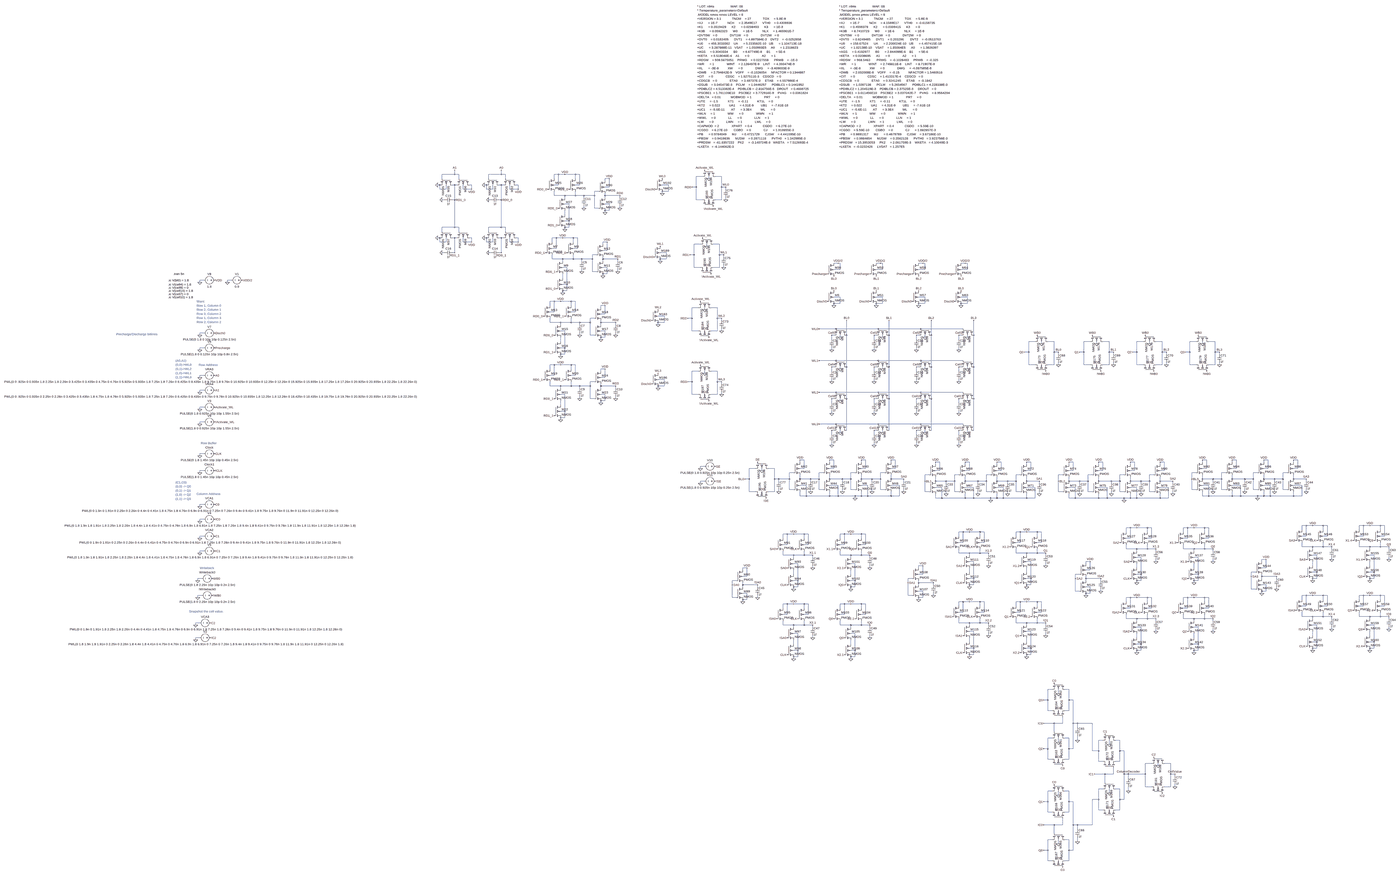
[diagram p0: schematic FinalProjectDraft4.asc, whole sheet]
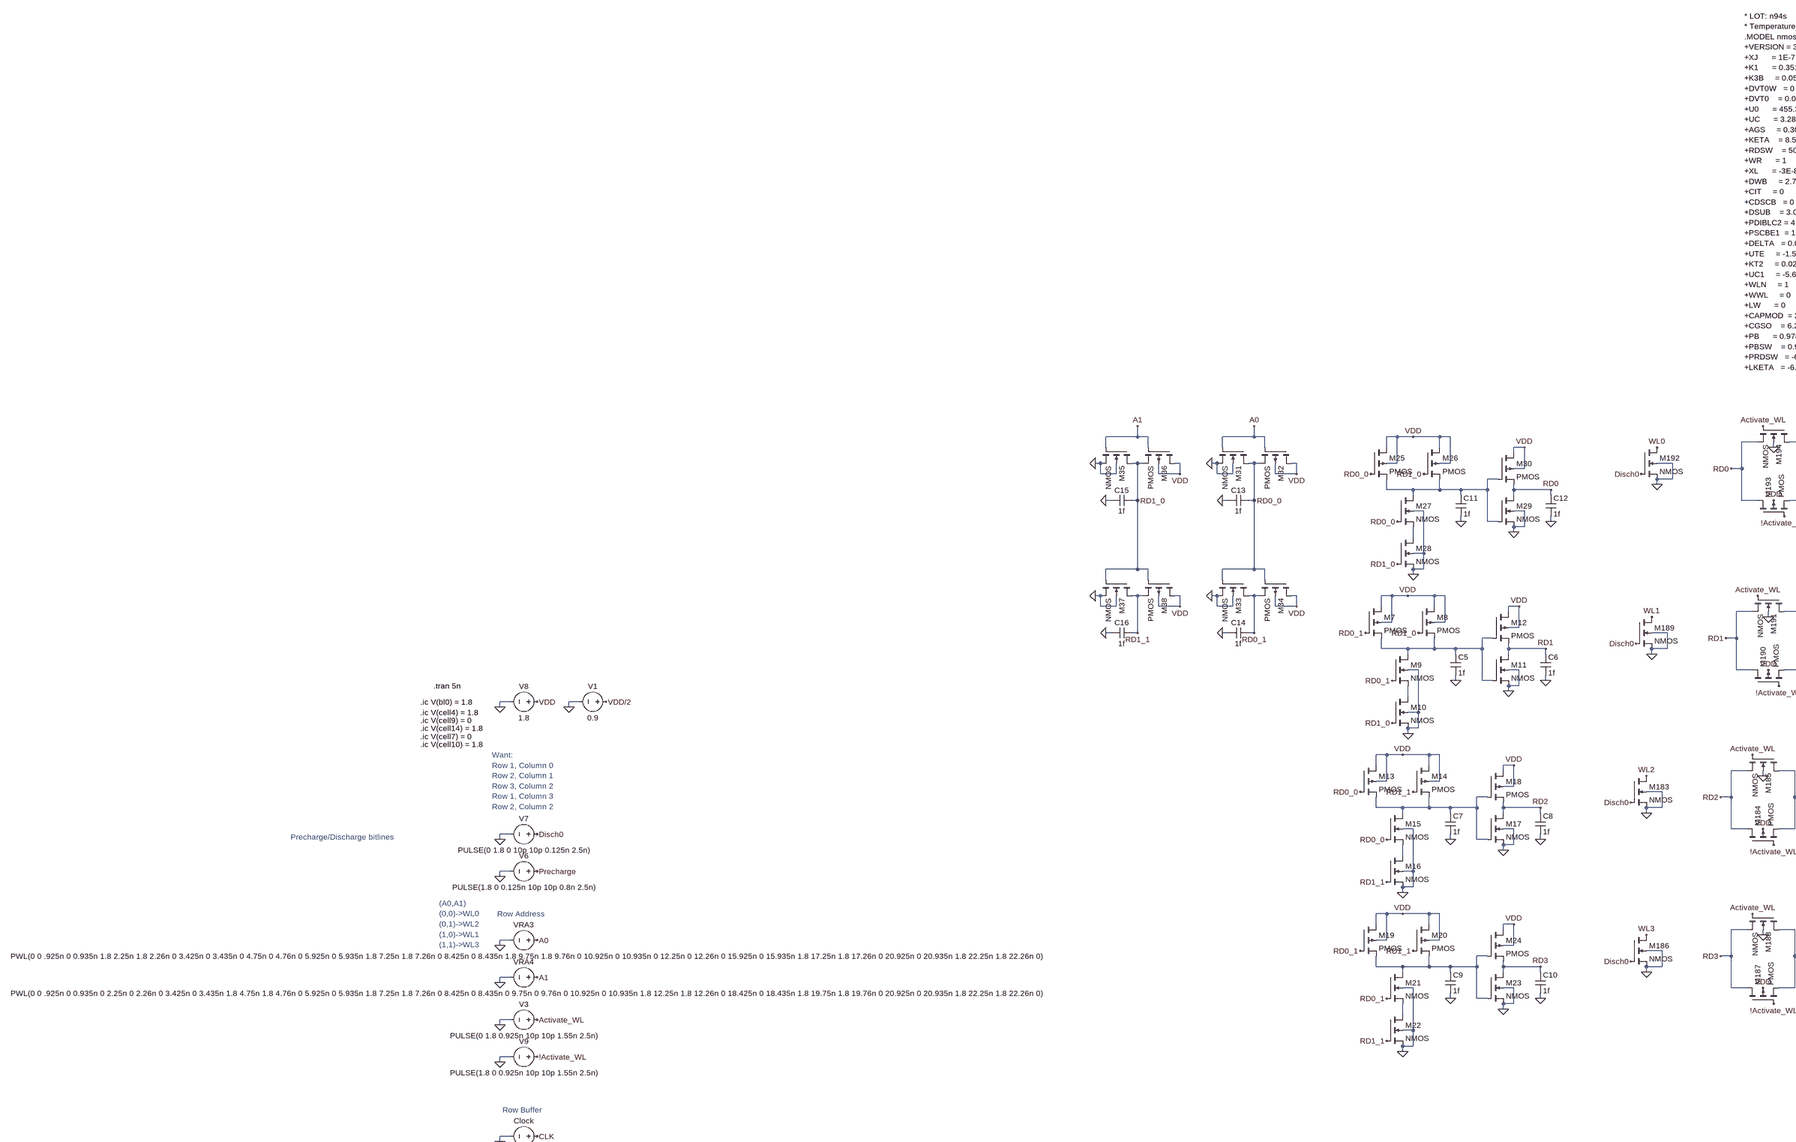
[diagram p1: schematic FinalProjectDraft4.asc, part, row 1 of 2, column 1 of 2]
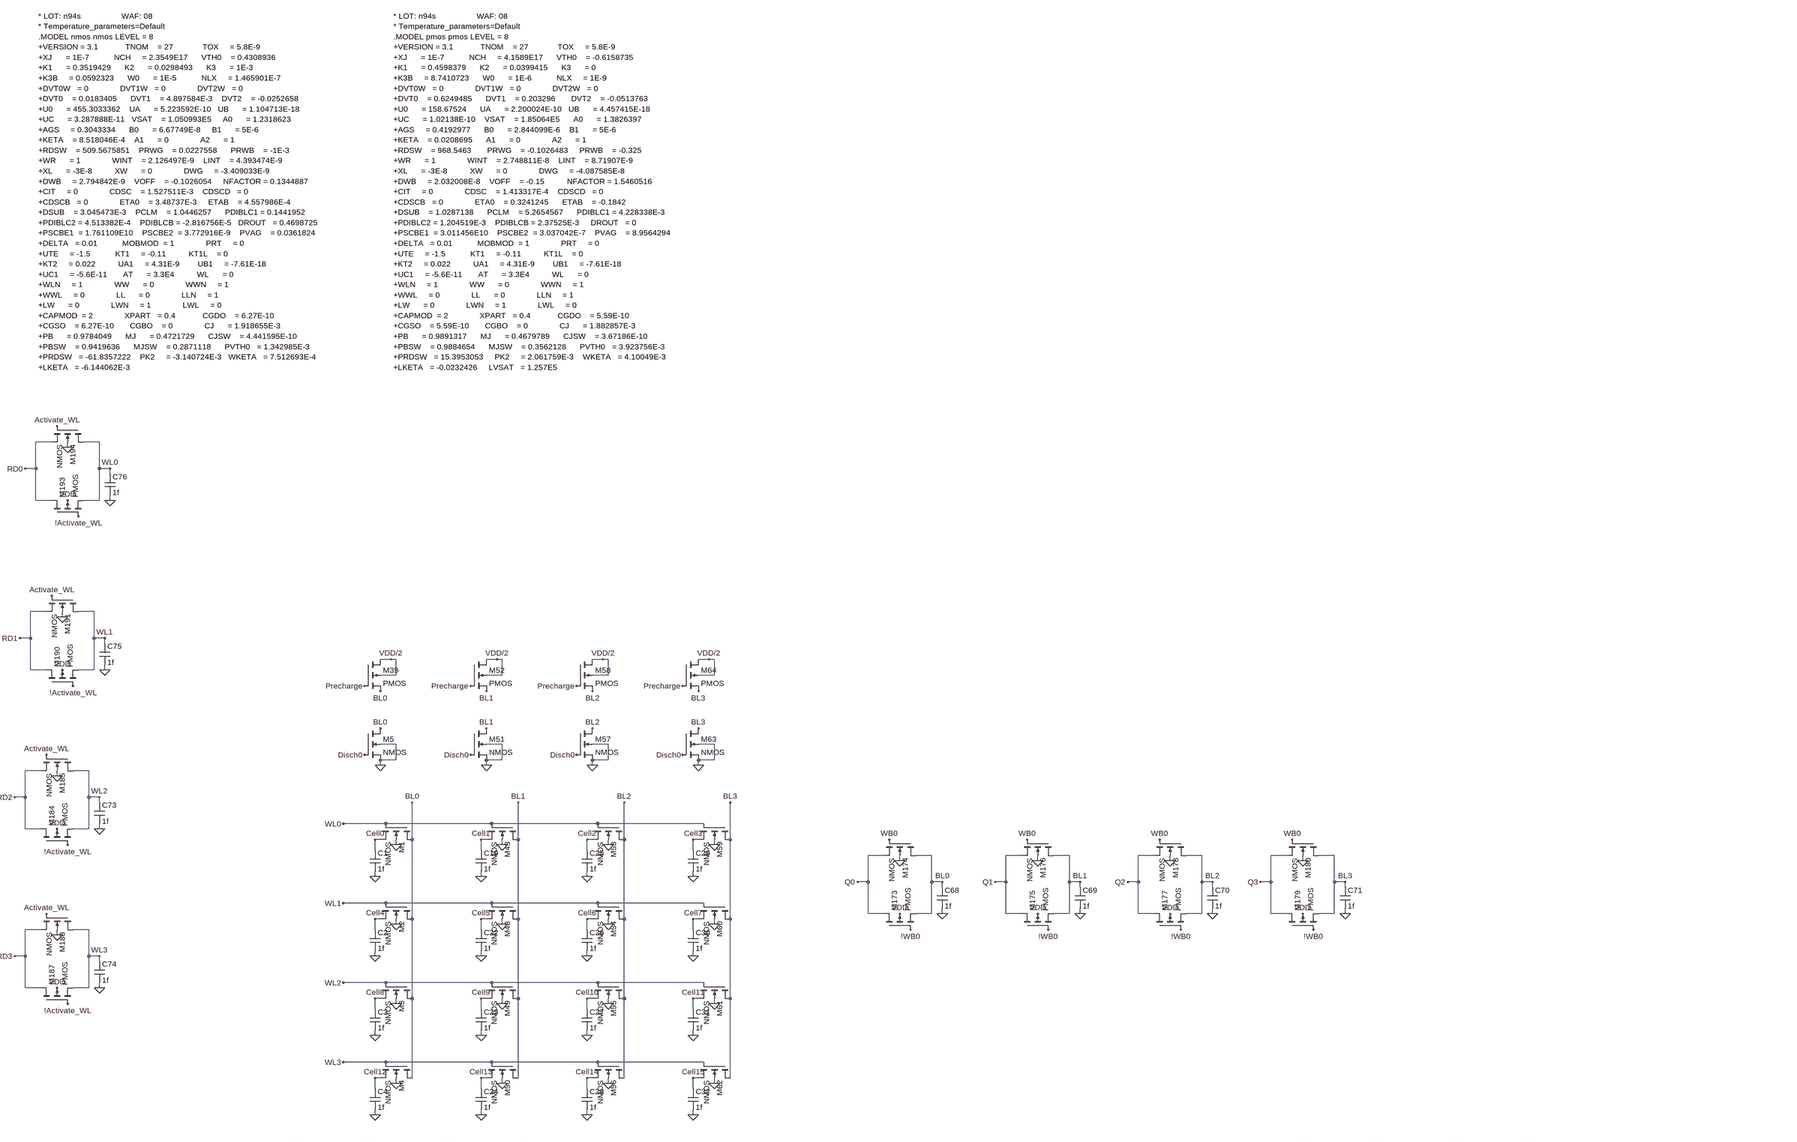
[diagram p2: schematic FinalProjectDraft4.asc, part, row 1 of 2, column 2 of 2]
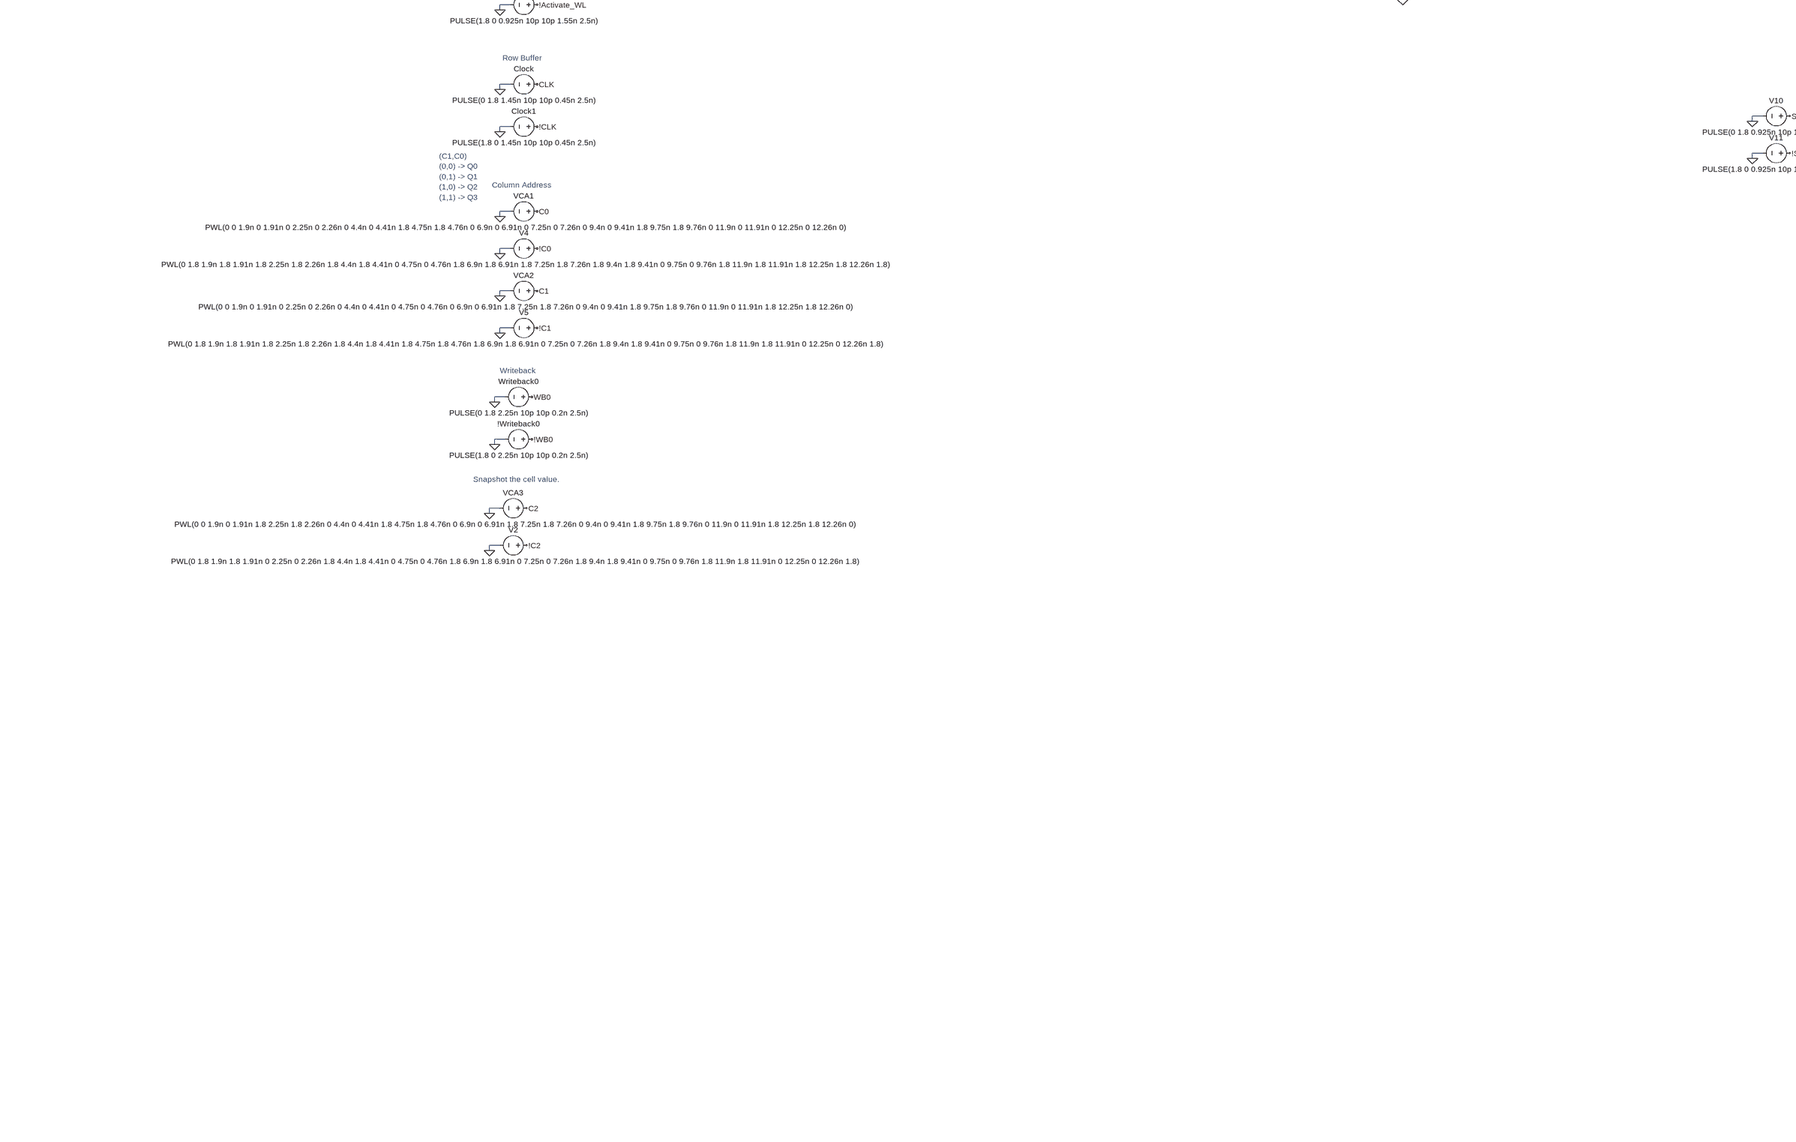
[diagram p3: schematic FinalProjectDraft4.asc, part, row 2 of 2, column 1 of 2]
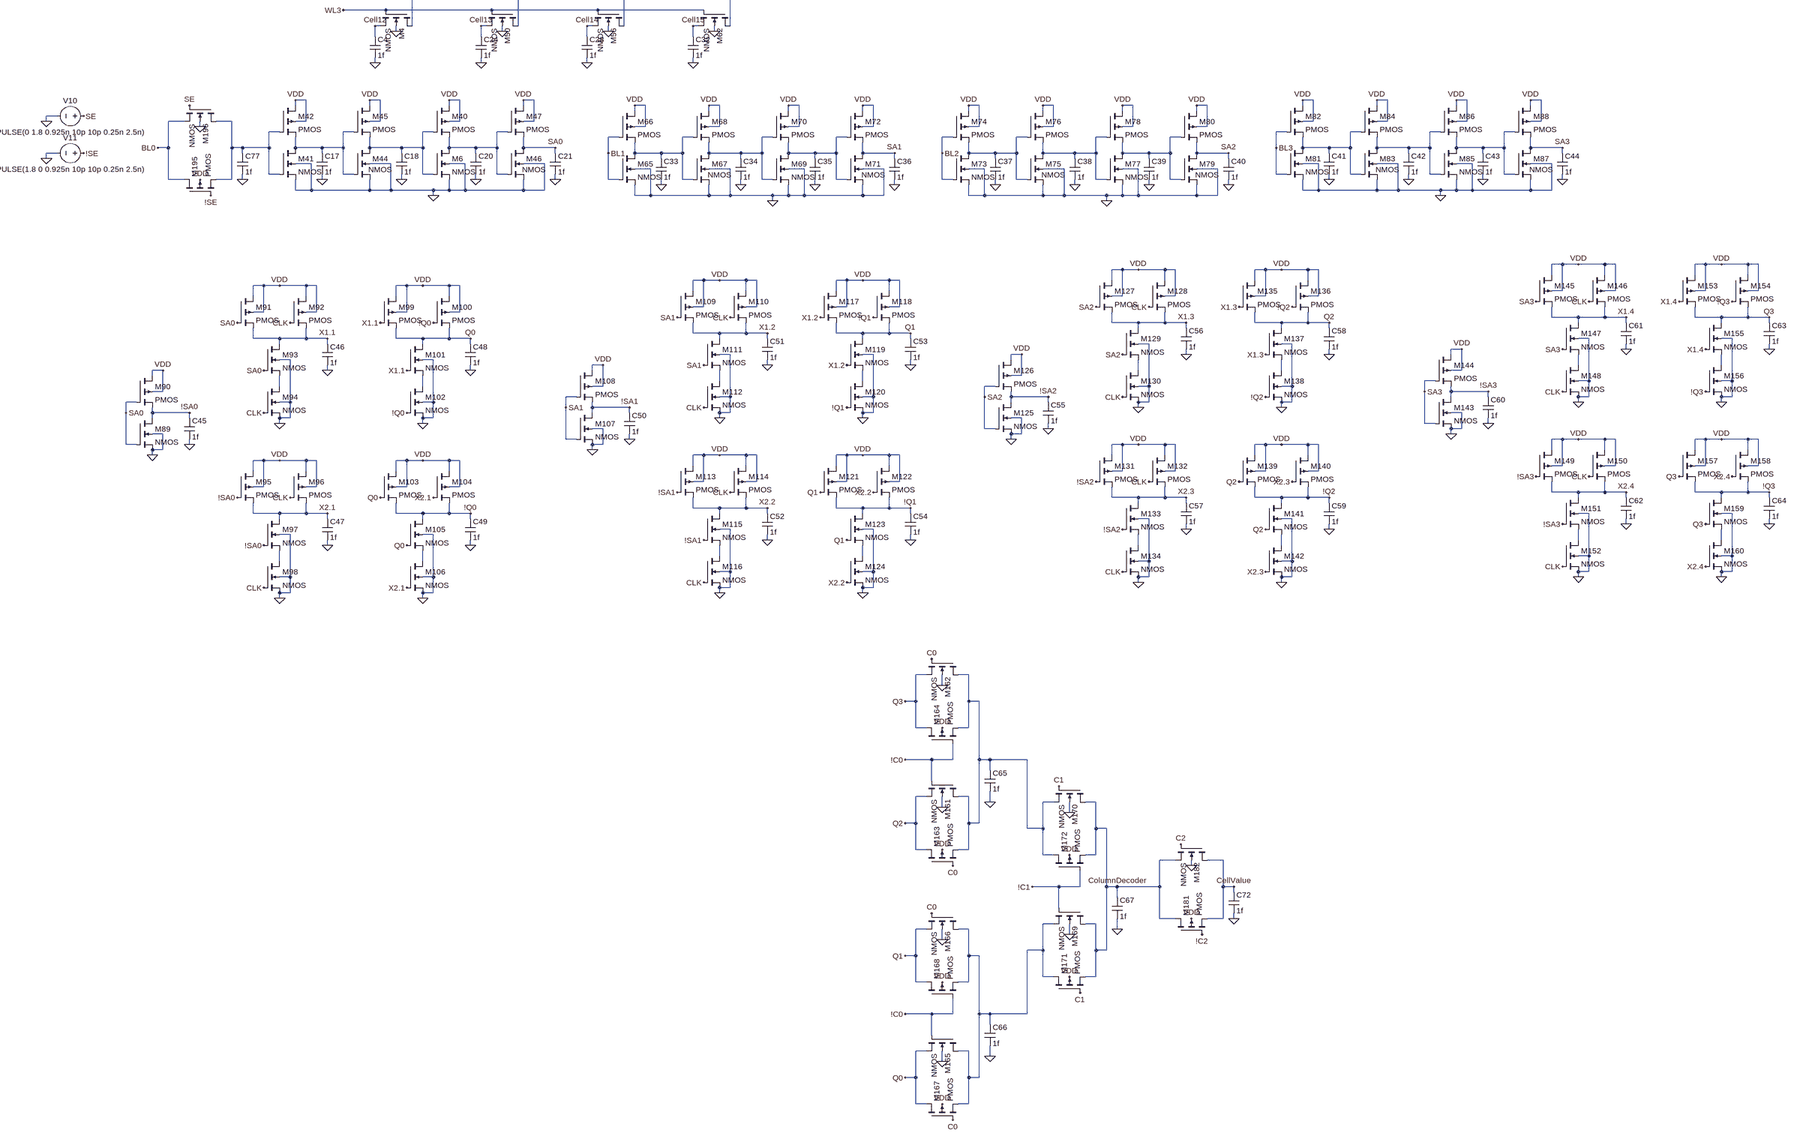
[diagram p4: schematic FinalProjectDraft4.asc, part, row 2 of 2, column 2 of 2]
* FinalProjectDraft4.asc
M1 BL0 WL0 Cell0 0 NMOS l=180n w=440n
C1 Cell0 0 1f
M2 BL0 WL1 Cell4 0 NMOS l=180n w=440n
C2 Cell4 0 1f
M3 BL0 WL2 Cell8 0 NMOS l=180n w=440n
C3 Cell8 0 1f
M4 BL0 WL3 Cell12 0 NMOS l=180n w=440n
C4 Cell12 0 1f
M5 BL0 Disch0 0 0 NMOS l=180n w=440n
M7 VDD RD0_1 N003 VDD PMOS l=180n w=880n
M8 VDD RD1_0 N003 VDD PMOS l=180n w=880n
M9 N003 RD0_1 N004 0 NMOS l=180n w=880n
M10 N004 RD1_0 0 0 NMOS l=180n w=880n
C5 N003 0 1f
M11 RD1 N003 0 0 NMOS l=180n w=440n
M12 VDD N003 RD1 VDD PMOS l=180n w=880n
C6 RD1 0 1f
M13 VDD RD0_0 N005 VDD PMOS l=180n w=880n
M14 VDD RD1_1 N005 VDD PMOS l=180n w=880n
M15 N005 RD0_0 N006 0 NMOS l=180n w=880n
M16 N006 RD1_1 0 0 NMOS l=180n w=880n
C7 N005 0 1f
M17 RD2 N005 0 0 NMOS l=180n w=440n
M18 VDD N005 RD2 VDD PMOS l=180n w=880n
C8 RD2 0 1f
M19 VDD RD0_1 N007 VDD PMOS l=180n w=880n
M20 VDD RD1_1 N007 VDD PMOS l=180n w=880n
M21 N007 RD0_1 N008 0 NMOS l=180n w=880n
M22 N008 RD1_1 0 0 NMOS l=180n w=880n
C9 N007 0 1f
M23 RD3 N007 0 0 NMOS l=180n w=440n
M24 VDD N007 RD3 VDD PMOS l=180n w=880n
C10 RD3 0 1f
M25 VDD RD0_0 N001 VDD PMOS l=180n w=880n
M26 VDD RD1_0 N001 VDD PMOS l=180n w=880n
M27 N001 RD0_0 N002 0 NMOS l=180n w=880n
M28 N002 RD1_0 0 0 NMOS l=180n w=880n
C11 N001 0 1f
M29 RD0 N001 0 0 NMOS l=180n w=440n
M30 VDD N001 RD0 VDD PMOS l=180n w=880n
C12 RD0 0 1f
M31 RD0_0 A0 0 0 NMOS l=180n w=440n
M32 VDD A0 RD0_0 VDD PMOS l=180n w=880n
C13 RD0_0 0 1f
M33 RD0_1 RD0_0 0 0 NMOS l=180n w=440n
M34 VDD RD0_0 RD0_1 VDD PMOS l=180n w=880n
C14 RD0_1 0 1f
M35 RD1_0 A1 0 0 NMOS l=180n w=440n
M36 VDD A1 RD1_0 VDD PMOS l=180n w=880n
C15 RD1_0 0 1f
M37 RD1_1 RD1_0 0 0 NMOS l=180n w=440n
M38 VDD RD1_0 RD1_1 VDD PMOS l=180n w=880n
C16 RD1_1 0 1f
M39 VDD/2 Precharge BL0 VDD/2 PMOS l=180n w=440n
M41 N010 N009 0 0 NMOS l=180n w=440n
M42 VDD N009 N010 VDD PMOS l=180n w=880n
M44 N011 N010 0 0 NMOS l=180n w=440n
M45 VDD N010 N011 VDD PMOS l=180n w=880n
VRA3 A0 0 PWL(0 0 .925n 0 0.935n 1.8 2.25n 1.8 2.26n 0 3.425n 0 3.435n 0 4.75n 0 4.76n 0 5.925n 0 5.935n 1.8 7.25n 1.8 7.26n 0 8.425n 0 8.435n 1.8 9.75n 1.8 9.76n 0 10.925n 0 10.935n 0 12.25n 0 12.26n 0 15.925n 0 15.935n 1.8 17.25n 1.8 17.26n 0 20.925n 0 20.935n 1.8 22.25n 1.8 22.26n 0)
VRA4 A1 0 PWL(0 0 .925n 0 0.935n 0 2.25n 0 2.26n 0 3.425n 0 3.435n 1.8 4.75n 1.8 4.76n 0 5.925n 0 5.935n 1.8 7.25n 1.8 7.26n 0 8.425n 0 8.435n 0 9.75n 0 9.76n 0 10.925n 0 10.935n 1.8 12.25n 1.8 12.26n 0 18.425n 0 18.435n 1.8 19.75n 1.8 19.76n 0 20.925n 0 20.935n 1.8 22.25n 1.8 22.26n 0)
VCA1 C0 0 PWL(0 0 1.9n 0 1.91n 0 2.25n 0 2.26n 0 4.4n 0 4.41n 1.8 4.75n 1.8 4.76n 0 6.9n 0 6.91n 0 7.25n 0 7.26n 0 9.4n 0 9.41n 1.8 9.75n 1.8 9.76n 0 11.9n 0 11.91n 0 12.25n 0 12.26n 0)
VCA2 C1 0 PWL(0 0 1.9n 0 1.91n 0 2.25n 0 2.26n 0 4.4n 0 4.41n 0 4.75n 0 4.76n 0 6.9n 0 6.91n 1.8 7.25n 1.8 7.26n 0 9.4n 0 9.41n 1.8 9.75n 1.8 9.76n 0 11.9n 0 11.91n 1.8 12.25n 1.8 12.26n 0)
V4 !C0 0 PWL(0 1.8 1.9n 1.8 1.91n 1.8 2.25n 1.8 2.26n 1.8 4.4n 1.8 4.41n 0 4.75n 0 4.76n 1.8 6.9n 1.8 6.91n 1.8 7.25n 1.8 7.26n 1.8 9.4n 1.8 9.41n 0 9.75n 0 9.76n 1.8 11.9n 1.8 11.91n 1.8 12.25n 1.8 12.26n 1.8)
V5 !C1 0 PWL(0 1.8 1.9n 1.8 1.91n 1.8 2.25n 1.8 2.26n 1.8 4.4n 1.8 4.41n 1.8 4.75n 1.8 4.76n 1.8 6.9n 1.8 6.91n 0 7.25n 0 7.26n 1.8 9.4n 1.8 9.41n 0 9.75n 0 9.76n 1.8 11.9n 1.8 11.91n 0 12.25n 0 12.26n 1.8)
V6 Precharge 0 PULSE(1.8 0 0.125n 10p 10p 0.8n 2.5n)
V7 Disch0 0 PULSE(0 1.8 0 10p 10p 0.125n 2.5n)
C17 N010 0 1f
C18 N011 0 1f
M6 N012 N011 0 0 NMOS l=180n w=440n
M40 VDD N011 N012 VDD PMOS l=180n w=880n
M46 SA0 N012 0 0 NMOS l=180n w=440n
M47 VDD N012 SA0 VDD PMOS l=180n w=880n
C20 N012 0 1f
C21 SA0 0 1f
V8 VDD 0 1.8
V1 VDD/2 0 0.9
M43 BL1 WL0 Cell1 0 NMOS l=180n w=440n
C19 Cell1 0 1f
M48 BL1 WL1 Cell5 0 NMOS l=180n w=440n
C22 Cell5 0 1f
M49 BL1 WL2 Cell9 0 NMOS l=180n w=440n
C23 Cell9 0 1f
M50 BL1 WL3 Cell13 0 NMOS l=180n w=440n
C24 Cell13 0 1f
M51 BL1 Disch0 0 0 NMOS l=180n w=440n
M52 VDD/2 Precharge BL1 VDD/2 PMOS l=180n w=440n
M53 BL2 WL0 Cell2 0 NMOS l=180n w=440n
C25 Cell2 0 1f
M54 BL2 WL1 Cell6 0 NMOS l=180n w=440n
C26 Cell6 0 1f
M55 BL2 WL2 Cell10 0 NMOS l=180n w=440n
C27 Cell10 0 1f
M56 BL2 WL3 Cell14 0 NMOS l=180n w=440n
C28 Cell14 0 1f
M57 BL2 Disch0 0 0 NMOS l=180n w=440n
M58 VDD/2 Precharge BL2 VDD/2 PMOS l=180n w=440n
M59 BL3 WL0 Cell3 0 NMOS l=180n w=440n
C29 Cell3 0 1f
M60 BL3 WL1 Cell7 0 NMOS l=180n w=440n
C30 Cell7 0 1f
M61 BL3 WL2 Cell11 0 NMOS l=180n w=440n
C31 Cell11 0 1f
M62 BL3 WL3 Cell15 0 NMOS l=180n w=440n
C32 Cell15 0 1f
M63 BL3 Disch0 0 0 NMOS l=180n w=440n
M64 VDD/2 Precharge BL3 VDD/2 PMOS l=180n w=440n
M65 N016 BL1 0 0 NMOS l=180n w=440n
M66 VDD BL1 N016 VDD PMOS l=180n w=880n
M67 N017 N016 0 0 NMOS l=180n w=440n
M68 VDD N016 N017 VDD PMOS l=180n w=880n
C33 N016 0 1f
C34 N017 0 1f
M69 N018 N017 0 0 NMOS l=180n w=440n
M70 VDD N017 N018 VDD PMOS l=180n w=880n
M71 SA1 N018 0 0 NMOS l=180n w=440n
M72 VDD N018 SA1 VDD PMOS l=180n w=880n
C35 N018 0 1f
C36 SA1 0 1f
M73 N019 BL2 0 0 NMOS l=180n w=440n
M74 VDD BL2 N019 VDD PMOS l=180n w=880n
M75 N020 N019 0 0 NMOS l=180n w=440n
M76 VDD N019 N020 VDD PMOS l=180n w=880n
C37 N019 0 1f
C38 N020 0 1f
M77 N021 N020 0 0 NMOS l=180n w=440n
M78 VDD N020 N021 VDD PMOS l=180n w=880n
M79 SA2 N021 0 0 NMOS l=180n w=440n
M80 VDD N021 SA2 VDD PMOS l=180n w=880n
C39 N021 0 1f
C40 SA2 0 1f
M81 N013 BL3 0 0 NMOS l=180n w=440n
M82 VDD BL3 N013 VDD PMOS l=180n w=880n
M83 N014 N013 0 0 NMOS l=180n w=440n
M84 VDD N013 N014 VDD PMOS l=180n w=880n
C41 N013 0 1f
C42 N014 0 1f
M85 N015 N014 0 0 NMOS l=180n w=440n
M86 VDD N014 N015 VDD PMOS l=180n w=880n
M87 SA3 N015 0 0 NMOS l=180n w=440n
M88 VDD N015 SA3 VDD PMOS l=180n w=880n
C43 N015 0 1f
C44 SA3 0 1f
M89 !SA0 SA0 0 0 NMOS l=180n w=440n
M90 VDD SA0 !SA0 VDD PMOS l=180n w=880n
C45 !SA0 0 1f
M91 VDD SA0 X1.1 VDD PMOS l=180n w=880n
M92 VDD CLK X1.1 VDD PMOS l=180n w=880n
M93 X1.1 SA0 N028 0 NMOS l=180n w=880n
M94 N028 CLK 0 0 NMOS l=180n w=880n
C46 X1.1 0 1f
M95 VDD !SA0 X2.1 VDD PMOS l=180n w=880n
M96 VDD CLK X2.1 VDD PMOS l=180n w=880n
M97 X2.1 !SA0 N036 0 NMOS l=180n w=880n
M98 N036 CLK 0 0 NMOS l=180n w=880n
C47 X2.1 0 1f
M99 VDD X1.1 Q0 VDD PMOS l=180n w=880n
M100 VDD !Q0 Q0 VDD PMOS l=180n w=880n
M101 Q0 X1.1 N029 0 NMOS l=180n w=880n
M102 N029 !Q0 0 0 NMOS l=180n w=880n
C48 Q0 0 1f
M103 VDD Q0 !Q0 VDD PMOS l=180n w=880n
M104 VDD X2.1 !Q0 VDD PMOS l=180n w=880n
M105 !Q0 Q0 N037 0 NMOS l=180n w=880n
M106 N037 X2.1 0 0 NMOS l=180n w=880n
C49 !Q0 0 1f
M107 !SA1 SA1 0 0 NMOS l=180n w=440n
M108 VDD SA1 !SA1 VDD PMOS l=180n w=880n
C50 !SA1 0 1f
M109 VDD SA1 X1.2 VDD PMOS l=180n w=880n
M110 VDD CLK X1.2 VDD PMOS l=180n w=880n
M111 X1.2 SA1 N026 0 NMOS l=180n w=880n
M112 N026 CLK 0 0 NMOS l=180n w=880n
C51 X1.2 0 1f
M113 VDD !SA1 X2.2 VDD PMOS l=180n w=880n
M114 VDD CLK X2.2 VDD PMOS l=180n w=880n
M115 X2.2 !SA1 N034 0 NMOS l=180n w=880n
M116 N034 CLK 0 0 NMOS l=180n w=880n
C52 X2.2 0 1f
M117 VDD X1.2 Q1 VDD PMOS l=180n w=880n
M118 VDD !Q1 Q1 VDD PMOS l=180n w=880n
M119 Q1 X1.2 N027 0 NMOS l=180n w=880n
M120 N027 !Q1 0 0 NMOS l=180n w=880n
C53 Q1 0 1f
M121 VDD Q1 !Q1 VDD PMOS l=180n w=880n
M122 VDD X2.2 !Q1 VDD PMOS l=180n w=880n
M123 !Q1 Q1 N035 0 NMOS l=180n w=880n
M124 N035 X2.2 0 0 NMOS l=180n w=880n
C54 !Q1 0 1f
M125 !SA2 SA2 0 0 NMOS l=180n w=440n
M126 VDD SA2 !SA2 VDD PMOS l=180n w=880n
C55 !SA2 0 1f
M127 VDD SA2 X1.3 VDD PMOS l=180n w=880n
M128 VDD CLK X1.3 VDD PMOS l=180n w=880n
M129 X1.3 SA2 N024 0 NMOS l=180n w=880n
M130 N024 CLK 0 0 NMOS l=180n w=880n
C56 X1.3 0 1f
M131 VDD !SA2 X2.3 VDD PMOS l=180n w=880n
M132 VDD CLK X2.3 VDD PMOS l=180n w=880n
M133 X2.3 !SA2 N032 0 NMOS l=180n w=880n
M134 N032 CLK 0 0 NMOS l=180n w=880n
C57 X2.3 0 1f
M135 VDD X1.3 Q2 VDD PMOS l=180n w=880n
M136 VDD !Q2 Q2 VDD PMOS l=180n w=880n
M137 Q2 X1.3 N025 0 NMOS l=180n w=880n
M138 N025 !Q2 0 0 NMOS l=180n w=880n
C58 Q2 0 1f
M139 VDD Q2 !Q2 VDD PMOS l=180n w=880n
M140 VDD X2.3 !Q2 VDD PMOS l=180n w=880n
M141 !Q2 Q2 N033 0 NMOS l=180n w=880n
M142 N033 X2.3 0 0 NMOS l=180n w=880n
C59 !Q2 0 1f
M143 !SA3 SA3 0 0 NMOS l=180n w=440n
M144 VDD SA3 !SA3 VDD PMOS l=180n w=880n
C60 !SA3 0 1f
M145 VDD SA3 X1.4 VDD PMOS l=180n w=880n
M146 VDD CLK X1.4 VDD PMOS l=180n w=880n
M147 X1.4 SA3 N022 0 NMOS l=180n w=880n
M148 N022 CLK 0 0 NMOS l=180n w=880n
C61 X1.4 0 1f
M149 VDD !SA3 X2.4 VDD PMOS l=180n w=880n
M150 VDD CLK X2.4 VDD PMOS l=180n w=880n
M151 X2.4 !SA3 N030 0 NMOS l=180n w=880n
M152 N030 CLK 0 0 NMOS l=180n w=880n
C62 X2.4 0 1f
M153 VDD X1.4 Q3 VDD PMOS l=180n w=880n
M154 VDD !Q3 Q3 VDD PMOS l=180n w=880n
M155 Q3 X1.4 N023 0 NMOS l=180n w=880n
M156 N023 !Q3 0 0 NMOS l=180n w=880n
C63 Q3 0 1f
M157 VDD Q3 !Q3 VDD PMOS l=180n w=880n
M158 VDD X2.4 !Q3 VDD PMOS l=180n w=880n
M159 !Q3 Q3 N031 0 NMOS l=180n w=880n
M160 N031 X2.4 0 0 NMOS l=180n w=880n
C64 !Q3 0 1f
M161 N038 !C0 Q2 0 NMOS l=180n w=440n
M162 N038 C0 Q3 0 NMOS l=180n w=440n
M163 Q2 C0 N038 VDD PMOS l=180n w=440n
M164 Q3 !C0 N038 VDD PMOS l=180n w=440n
C65 N038 0 1f
M165 N039 !C0 Q0 0 NMOS l=180n w=440n
M166 N039 C0 Q1 0 NMOS l=180n w=440n
M167 Q0 C0 N039 VDD PMOS l=180n w=440n
M168 Q1 !C0 N039 VDD PMOS l=180n w=440n
C66 N039 0 1f
M169 ColumnDecoder !C1 N039 0 NMOS l=180n w=440n
M170 ColumnDecoder C1 N038 0 NMOS l=180n w=440n
M171 N039 C1 ColumnDecoder VDD PMOS l=180n w=440n
M172 N038 !C1 ColumnDecoder VDD PMOS l=180n w=440n
C67 ColumnDecoder 0 1f
V§Clock CLK 0 PULSE(0 1.8 1.45n 10p 10p 0.45n 2.5n)
V§Clock1 !CLK 0 PULSE(1.8 0 1.45n 10p 10p 0.45n 2.5n)
M173 Q0 !WB0 BL0 VDD PMOS l=180n w=440n
M174 BL0 WB0 Q0 0 NMOS l=180n w=440n
C68 BL0 0 1f
M175 Q1 !WB0 BL1 VDD PMOS l=180n w=880n
M176 BL1 WB0 Q1 0 NMOS l=180n w=440n
C69 BL1 0 1f
M177 Q2 !WB0 BL2 VDD PMOS l=180n w=880n
M178 BL2 WB0 Q2 0 NMOS l=180n w=440n
C70 BL2 0 1f
M179 Q3 !WB0 BL3 VDD PMOS l=180n w=880n
M180 BL3 WB0 Q3 0 NMOS l=180n w=440n
C71 BL3 0 1f
V§Writeback0 WB0 0 PULSE(0 1.8 2.25n 10p 10p 0.2n 2.5n)
V§!Writeback0 !WB0 0 PULSE(1.8 0 2.25n 10p 10p 0.2n 2.5n)
M181 ColumnDecoder !C2 CellValue VDD PMOS l=180n w=440n
M182 CellValue C2 ColumnDecoder 0 NMOS l=180n w=440n
C72 CellValue 0 1f
VCA3 C2 0 PWL(0 0 1.9n 0 1.91n 1.8 2.25n 1.8 2.26n 0 4.4n 0 4.41n 1.8 4.75n 1.8 4.76n 0 6.9n 0 6.91n 1.8 7.25n 1.8 7.26n 0 9.4n 0 9.41n 1.8 9.75n 1.8 9.76n 0 11.9n 0 11.91n 1.8 12.25n 1.8 12.26n 0)
V2 !C2 0 PWL(0 1.8 1.9n 1.8 1.91n 0 2.25n 0 2.26n 1.8 4.4n 1.8 4.41n 0 4.75n 0 4.76n 1.8 6.9n 1.8 6.91n 0 7.25n 0 7.26n 1.8 9.4n 1.8 9.41n 0 9.75n 0 9.76n 1.8 11.9n 1.8 11.91n 0 12.25n 0 12.26n 1.8)
M183 WL2 Disch0 0 0 NMOS l=180n w=440n
V3 Activate_WL 0 PULSE(0 1.8 0.925n 10p 10p 1.55n 2.5n)
M184 RD2 !Activate_WL WL2 VDD PMOS l=180n w=440n
M185 WL2 Activate_WL RD2 0 NMOS l=180n w=440n
C73 WL2 0 1f
V9 !Activate_WL 0 PULSE(1.8 0 0.925n 10p 10p 1.55n 2.5n)
M186 WL3 Disch0 0 0 NMOS l=180n w=440n
M187 RD3 !Activate_WL WL3 VDD PMOS l=180n w=440n
M188 WL3 Activate_WL RD3 0 NMOS l=180n w=440n
C74 WL3 0 1f
M189 WL1 Disch0 0 0 NMOS l=180n w=440n
M190 RD1 !Activate_WL WL1 VDD PMOS l=180n w=440n
M191 WL1 Activate_WL RD1 0 NMOS l=180n w=440n
C75 WL1 0 1f
M192 WL0 Disch0 0 0 NMOS l=180n w=440n
M193 RD0 !Activate_WL WL0 VDD PMOS l=180n w=440n
M194 WL0 Activate_WL RD0 0 NMOS l=180n w=440n
C76 WL0 0 1f
M195 BL0 !SE N009 VDD PMOS l=180n w=440n
M196 N009 SE BL0 0 NMOS l=180n w=440n
C77 N009 0 1f
V10 SE 0 PULSE(0 1.8 0.925n 10p 10p 0.25n 2.5n)
V11 !SE 0 PULSE(1.8 0 0.925n 10p 10p 0.25n 2.5n)
.model NMOS NMOS
.model PMOS PMOS
.lib standard.mos
* LOT: n94s                  WAF: 08
* Temperature_parameters=Default
.MODEL nmos nmos LEVEL = 8
+VERSION = 3.1            TNOM    = 27             TOX     = 5.8E-9
+XJ      = 1E-7           NCH     = 2.3549E17      VTH0    = 0.4308936
+K1      = 0.3519429      K2      = 0.0298493      K3      = 1E-3
+K3B     = 0.0592323      W0      = 1E-5           NLX     = 1.465901E-7
+DVT0W   = 0              DVT1W   = 0              DVT2W   = 0
+DVT0    = 0.0183405      DVT1    = 4.897584E-3    DVT2    = -0.0252658
+U0      = 455.3033362    UA      = 5.223592E-10   UB      = 1.104713E-18
+UC      = 3.287888E-11   VSAT    = 1.050993E5     A0      = 1.2318623
+AGS     = 0.3043334      B0      = 6.67749E-8     B1      = 5E-6
+KETA    = 8.518046E-4    A1      = 0              A2      = 1
+RDSW    = 509.5675851    PRWG    = 0.0227558      PRWB    = -1E-3
+WR      = 1              WINT    = 2.126497E-9    LINT    = 4.393474E-9
+XL      = -3E-8          XW      = 0              DWG     = -3.409033E-9
+DWB     = 2.794842E-9    VOFF    = -0.1026054     NFACTOR = 0.1344887
+CIT     = 0              CDSC    = 1.527511E-3    CDSCD   = 0
+CDSCB   = 0              ETA0    = 3.48737E-3     ETAB    = 4.557986E-4
+DSUB    = 3.045473E-3    PCLM    = 1.0446257      PDIBLC1 = 0.1441952
+PDIBLC2 = 4.513382E-4    PDIBLCB = -2.816756E-5   DROUT   = 0.4698725
+PSCBE1  = 1.761109E10    PSCBE2  = 3.772916E-9    PVAG    = 0.0361824
+DELTA   = 0.01           MOBMOD  = 1              PRT     = 0
+UTE     = -1.5           KT1     = -0.11          KT1L    = 0
+KT2     = 0.022          UA1     = 4.31E-9        UB1     = -7.61E-18
+UC1     = -5.6E-11       AT      = 3.3E4          WL      = 0
+WLN     = 1              WW      = 0              WWN     = 1
+WWL     = 0              LL      = 0              LLN     = 1
+LW      = 0              LWN     = 1              LWL     = 0
+CAPMOD  = 2              XPART   = 0.4            CGDO    = 6.27E-10
+CGSO    = 6.27E-10       CGBO    = 0              CJ      = 1.918655E-3
+PB      = 0.9784049      MJ      = 0.4721729      CJSW    = 4.441595E-10
+PBSW    = 0.9419636      MJSW    = 0.2871118      PVTH0   = 1.342985E-3
+PRDSW   = -61.8357222    PK2     = -3.140724E-3   WKETA   = 7.512693E-4
+LKETA   = -6.144062E-3
* LOT: n94s                  WAF: 08
* Temperature_parameters=Default
.MODEL pmos pmos LEVEL = 8
+VERSION = 3.1            TNOM    = 27             TOX     = 5.8E-9
+XJ      = 1E-7           NCH     = 4.1589E17      VTH0    = -0.6158735
+K1      = 0.4598379      K2      = 0.0399415      K3      = 0
+K3B     = 8.7410723      W0      = 1E-6           NLX     = 1E-9
+DVT0W   = 0              DVT1W   = 0              DVT2W   = 0
+DVT0    = 0.6249485      DVT1    = 0.203296       DVT2    = -0.0513763
+U0      = 158.67524      UA      = 2.200024E-10   UB      = 4.457415E-18
+UC      = 1.02138E-10    VSAT    = 1.85064E5      A0      = 1.3826397
+AGS     = 0.4192977      B0      = 2.844099E-6    B1      = 5E-6
+KETA    = 0.0208695      A1      = 0              A2      = 1
+RDSW    = 968.5463       PRWG    = -0.1026483     PRWB    = -0.325
+WR      = 1              WINT    = 2.748811E-8    LINT    = 8.71907E-9
+XL      = -3E-8          XW      = 0              DWG     = -4.087585E-8
+DWB     = 2.032008E-8    VOFF    = -0.15          NFACTOR = 1.5460516
+CIT     = 0              CDSC    = 1.413317E-4    CDSCD   = 0
+CDSCB   = 0              ETA0    = 0.3241245      ETAB    = -0.1842
+DSUB    = 1.0287138      PCLM    = 5.2654567      PDIBLC1 = 4.228338E-3
+PDIBLC2 = 1.204519E-3    PDIBLCB = 2.37525E-3     DROUT   = 0
+PSCBE1  = 3.011456E10    PSCBE2  = 3.037042E-7    PVAG    = 8.9564294
+DELTA   = 0.01           MOBMOD  = 1              PRT     = 0
+UTE     = -1.5           KT1     = -0.11          KT1L    = 0
+KT2     = 0.022          UA1     = 4.31E-9        UB1     = -7.61E-18
+UC1     = -5.6E-11       AT      = 3.3E4          WL      = 0
+WLN     = 1              WW      = 0              WWN     = 1
+WWL     = 0              LL      = 0              LLN     = 1
+LW      = 0              LWN     = 1              LWL     = 0
+CAPMOD  = 2              XPART   = 0.4            CGDO    = 5.59E-10
+CGSO    = 5.59E-10       CGBO    = 0              CJ      = 1.882857E-3
+PB      = 0.9891317      MJ      = 0.4679789      CJSW    = 3.67186E-10
+PBSW    = 0.9884654      MJSW    = 0.3562128      PVTH0   = 3.923756E-3
+PRDSW   = 15.3953053     PK2     = 2.061759E-3    WKETA   = 4.10049E-3
+LKETA   = -0.0232426     LVSAT   = 1.257E5
* (C1,C0)
* (0,0) -> Q0
* (0,1) -> Q1
* (1,0) -> Q2
* (1,1) -> Q3
* Row Address
* Column Address
* (A0,A1)
* (0,0)->WL0
* (0,1)->WL2
* (1,0)->WL1
* (1,1)->WL3
* Precharge/Discharge bitlines
* Want:
* Row 1, Column 0
* Row 2, Column 1
* Row 3, Column 2
* Row 1, Column 3
* Row 2, Column 2
.ic V(cell9) = 0
.ic V(cell4) = 1.8
.tran 5n
* Row Buffer
* Writeback
.ic V(bl0) = 1.8
.ic V(cell14) = 1.8
.ic V(cell7) = 0
.ic V(cell10) = 1.8
* Snapshot the cell value.
.backanno
.end